# EAGLE design untitled (EAGLE 7.5.0)
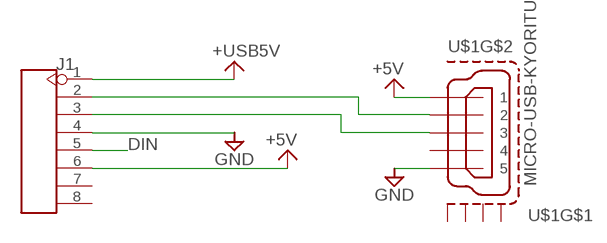
[diagram p0: schematic, sheet 1]

## Parts
J1  HEADER-8P-2.54  [8P-2.54]
U$1  MICRO-USB-KYORITU  [ZX62R-B-5P]

## Nets
+5V: J1.6 U$1.5
+USB5V: J1.1
DIN: J1.5
GND: J1.4 U$1.1
N$1: J1.2 U$1.4
N$2: J1.3 U$1.3
Unconnected: J1.7 J1.8 U$1.2 U$1.M1(S1) U$1.M2(S2) U$1.M3(S3) U$1.M4(S4)

## Library data of the parts
J1 = Connector :HEADER-8P
U$1 = con-hirose1:MICRO-USB-KYORITU

## Board
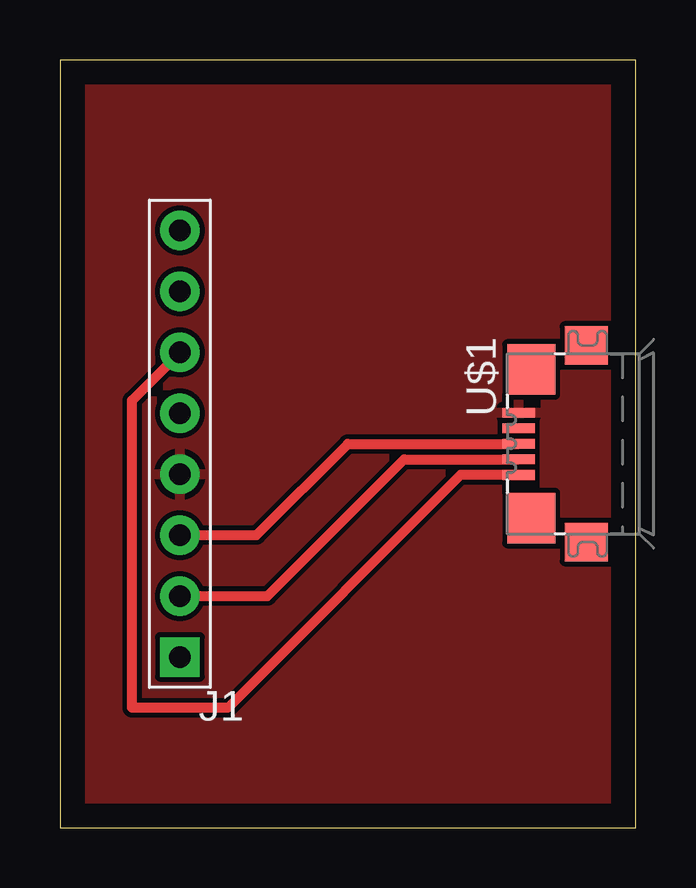
[diagram p1: board, top side]

Size 24 x 32 mm. Coordinates in mm from the lower left corner, seen from the top.
Outline: 0,0 24,0 24,32 0,32 0,0
Copper layers (1*16): Top 0.035mm / dielectric 1.5mm / Bottom 0.035mm
Design rules "default": minimum track width 10mil, minimum drill 24mil, track to track 8mil, track to pad 8mil, pad to pad 8mil, via to via 8mil, smd to smd 8mil, copper to edge 40mil, drill to drill 8mil, minimum pad ring 10mil, minimum via ring 8mil, stop-mask expansion 4mil, vias tented up to drill 0mil, thermal gap 10mil

### Footprints (pad centres in the part's own frame; a part is rotated, then mirrored left to right if it is on the bottom)
8P-2.54 = drill 0.9 pad 1.651 square: 1 0,8.89 | drill 0.9 pad 1.651: 2 0,6.35; 3 0,3.81; 4 0,1.27; 5 0,-1.27; 6 0,-3.81; 7 0,-6.35; 8 0,-8.89
ZX62R-B-5P = smd 1.35 x 0.4: 1 2.875,-1.3; 2 2.875,-0.65; 3 2.875,0; 4 2.875,0.65; 5 2.875,1.3 | smd 1.8 x 1.6: M1 0.05,-4.1; M2 0.05,4.1 | smd 2 x 2.1: M3 2.35,3.1; M4 2.35,-3.1

### Placement (x,y rotation side)
J1  5,16 180 top
U$1  22,16 180 top

### Tracks (layer width: path | path; a pad name or v marks a point on that pad's centre or on a via)
+5V
  Top 0.406: U$1.5 16.7,14.7 7,5 3,5 3,17.81 J1.6
GND
  pour Top: 0,32 24,32 24,0 0,0
N$1
  Top 0.406: J1.2 8.65,9.65 14.35,15.35 U$1.4
N$2
  Top 0.406: J1.3 8.19,12.19 12,16 U$1.3